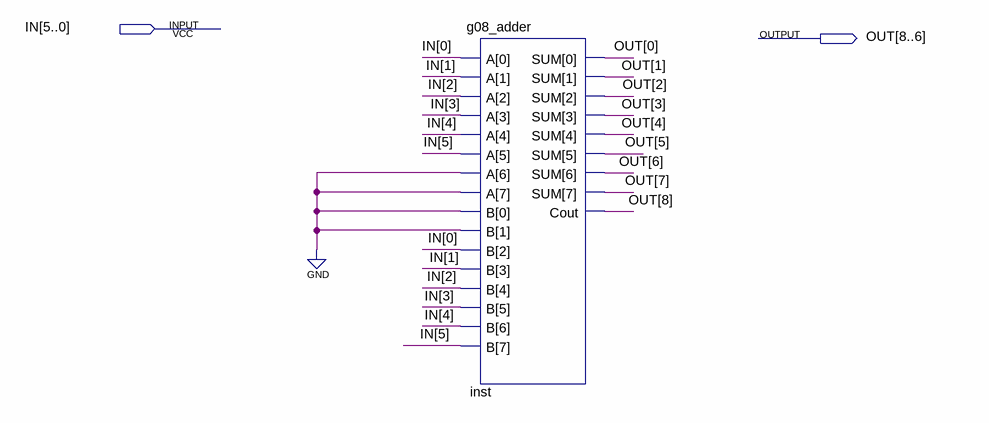
[diagram p0: schematic sheet]
// Quartus schematic FLOOR13.bdf as structural Verilog: 1 symbols, 2 pins
module FLOOR13 (
  input  [5:0] IN,
  output [8:0] OUT
);

  g08_adder inst (.A({2'b00, IN}), .B({IN, 2'b00}), .SUM(OUT[7:0]), .Cout(OUT[8]));
endmodule
